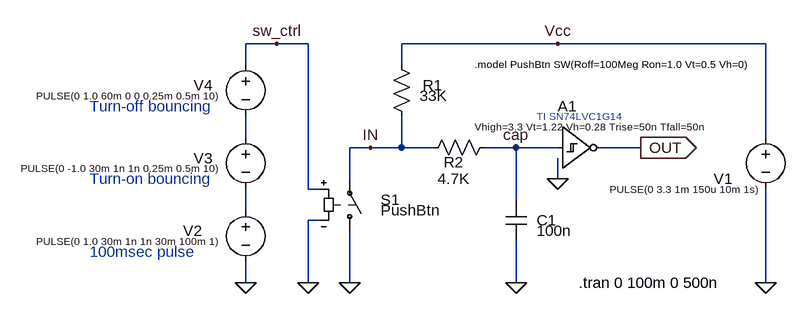
[diagram p0: schematic debouncing_schmitt.asc]
debouncing_schmitt.asc, the LTspice schematic file:
Version 4
SHEET 1 2124 680
WIRE -704 -912 -752 -912
WIRE -656 -912 -704 -912
WIRE -272 -912 -512 -912
WIRE 48 -912 -272 -912
WIRE -752 -880 -752 -912
WIRE -512 -880 -512 -912
WIRE -752 -768 -752 -800
WIRE 48 -768 48 -912
WIRE -560 -752 -592 -752
WIRE -512 -752 -512 -800
WIRE -512 -752 -560 -752
WIRE -464 -752 -512 -752
WIRE -336 -752 -384 -752
WIRE -272 -752 -336 -752
WIRE -144 -752 -208 -752
WIRE -592 -704 -592 -752
WIRE -272 -704 -272 -736
WIRE -656 -688 -656 -912
WIRE -640 -688 -656 -688
WIRE -336 -672 -336 -752
WIRE -752 -656 -752 -688
WIRE -640 -640 -656 -640
WIRE -752 -544 -752 -576
WIRE -656 -544 -656 -640
WIRE -592 -544 -592 -624
WIRE -336 -544 -336 -608
WIRE 48 -544 48 -688
FLAG 48 -544 0
FLAG -752 -544 0
FLAG -144 -752 OUT
IOPIN -144 -752 Out
FLAG -272 -704 0
FLAG -592 -544 0
FLAG -656 -544 0
FLAG -336 -544 0
FLAG -560 -752 IN
FLAG -336 -752 cap
FLAG -272 -912 Vcc
FLAG -704 -912 sw_ctrl
SYMBOL voltage 48 -784 R0
WINDOW 0 -80 80 Left 2
WINDOW 3 -16 96 Right 1
WINDOW 123 0 0 Left 2
WINDOW 39 0 0 Left 2
SYMATTR InstName V1
SYMATTR Value PULSE(0 3.3 1m 150u 10m 1s)
SYMBOL cap -352 -672 R0
WINDOW 0 48 32 Left 2
WINDOW 3 48 48 Left 2
SYMATTR InstName C1
SYMATTR Value 100n
SYMBOL sw -592 -608 M180
WINDOW 0 48 64 Left 2
WINDOW 3 48 48 Left 2
SYMATTR InstName S1
SYMATTR Value PushBtn
SYMBOL voltage -752 -896 R0
WINDOW 0 -80 48 Left 2
WINDOW 3 -48 64 Right 1
WINDOW 123 0 0 Left 2
WINDOW 39 0 0 Left 2
SYMATTR InstName V4
SYMATTR Value PULSE(0 1.0 60m 0 0 0.25m 0.5m 10)
SYMBOL res -528 -896 R0
WINDOW 0 48 48 Left 2
WINDOW 3 44 64 Left 2
SYMATTR InstName R1
SYMATTR Value 33K
SYMBOL res -368 -768 R90
WINDOW 0 54 64 VBottom 2
WINDOW 3 48 64 VTop 2
SYMATTR InstName R2
SYMATTR Value 4.7K
SYMBOL Digital\\schmtinv -272 -816 R0
WINDOW 0 0 0 Left 2
WINDOW 3 -128 32 Left 1
SYMATTR InstName A1
SYMATTR Value Vhigh=3.3 Vt=1.22 Vh=0.28 Trise=50n Tfall=50n
SYMBOL voltage -752 -672 R0
WINDOW 0 -96 48 Left 2
WINDOW 3 -48 64 Right 1
WINDOW 123 0 0 Left 2
WINDOW 39 0 0 Left 2
SYMATTR InstName V2
SYMATTR Value PULSE(0 1.0 30m 1n 1n 30m 100m 1)
SYMBOL voltage -752 -784 R0
WINDOW 0 -80 48 Left 2
WINDOW 3 -48 64 Right 1
WINDOW 123 0 0 Left 2
WINDOW 39 0 0 Left 2
SYMATTR InstName V3
SYMATTR Value PULSE(0 -1.0 30m 1n 1n 0.25m 0.5m 10)
TEXT -400 -880 Left 1 !.model PushBtn SW(Roff=100Meg Ron=1.0 Vt=0.5 Vh=0)
TEXT -240 -544 Left 2 !.tran 0 100m 0 500n
TEXT -304 -800 Left 1 ;TI SN74LVC1G14
TEXT -992 -592 Left 2 ;100msec pulse
TEXT -992 -704 Left 2 ;Turn-on bouncing
TEXT -992 -816 Left 2 ;Turn-off bouncing

The netlist it stands for:
* debouncing_schmitt.asc
V1 Vcc 0 PULSE(0 3.3 1m 150u 10m 1s)
C1 cap 0 100n
S1 0 IN sw_ctrl 0 PushBtn
V4 sw_ctrl N001 PULSE(0 1.0 60m 0 0 0.25m 0.5m 10)
R1 Vcc IN 33K
R2 cap IN 4.7K
A1 cap 0 0 0 0 OUT 0 0 SCHMITT Vhigh=3.3 Vt=1.22 Vh=0.28 Trise=50n Tfall=50n
V2 N002 0 PULSE(0 1.0 30m 1n 1n 30m 100m 1)
V3 N001 N002 PULSE(0 -1.0 30m 1n 1n 0.25m 0.5m 10)
.model PushBtn SW(Roff=100Meg Ron=1.0 Vt=0.5 Vh=0)
.tran 0 100m 0 500n
* TI SN74LVC1G14
* 100msec pulse
* Turn-on bouncing
* Turn-off bouncing
.backanno
.end